# EasyEDA Pro project 工科赛(1)(2)(1).eprj

# Schematic Schematic1
Board Name: 工科赛; Create Date: 2025-07-13; Page Name: P1; Project Name: 工科赛(1)(2)(1); Schematic Name: Schematic1; Update Date: 2025-10-09; Company: 嘉立创EDA; Page Size: A4; Version: V1.0
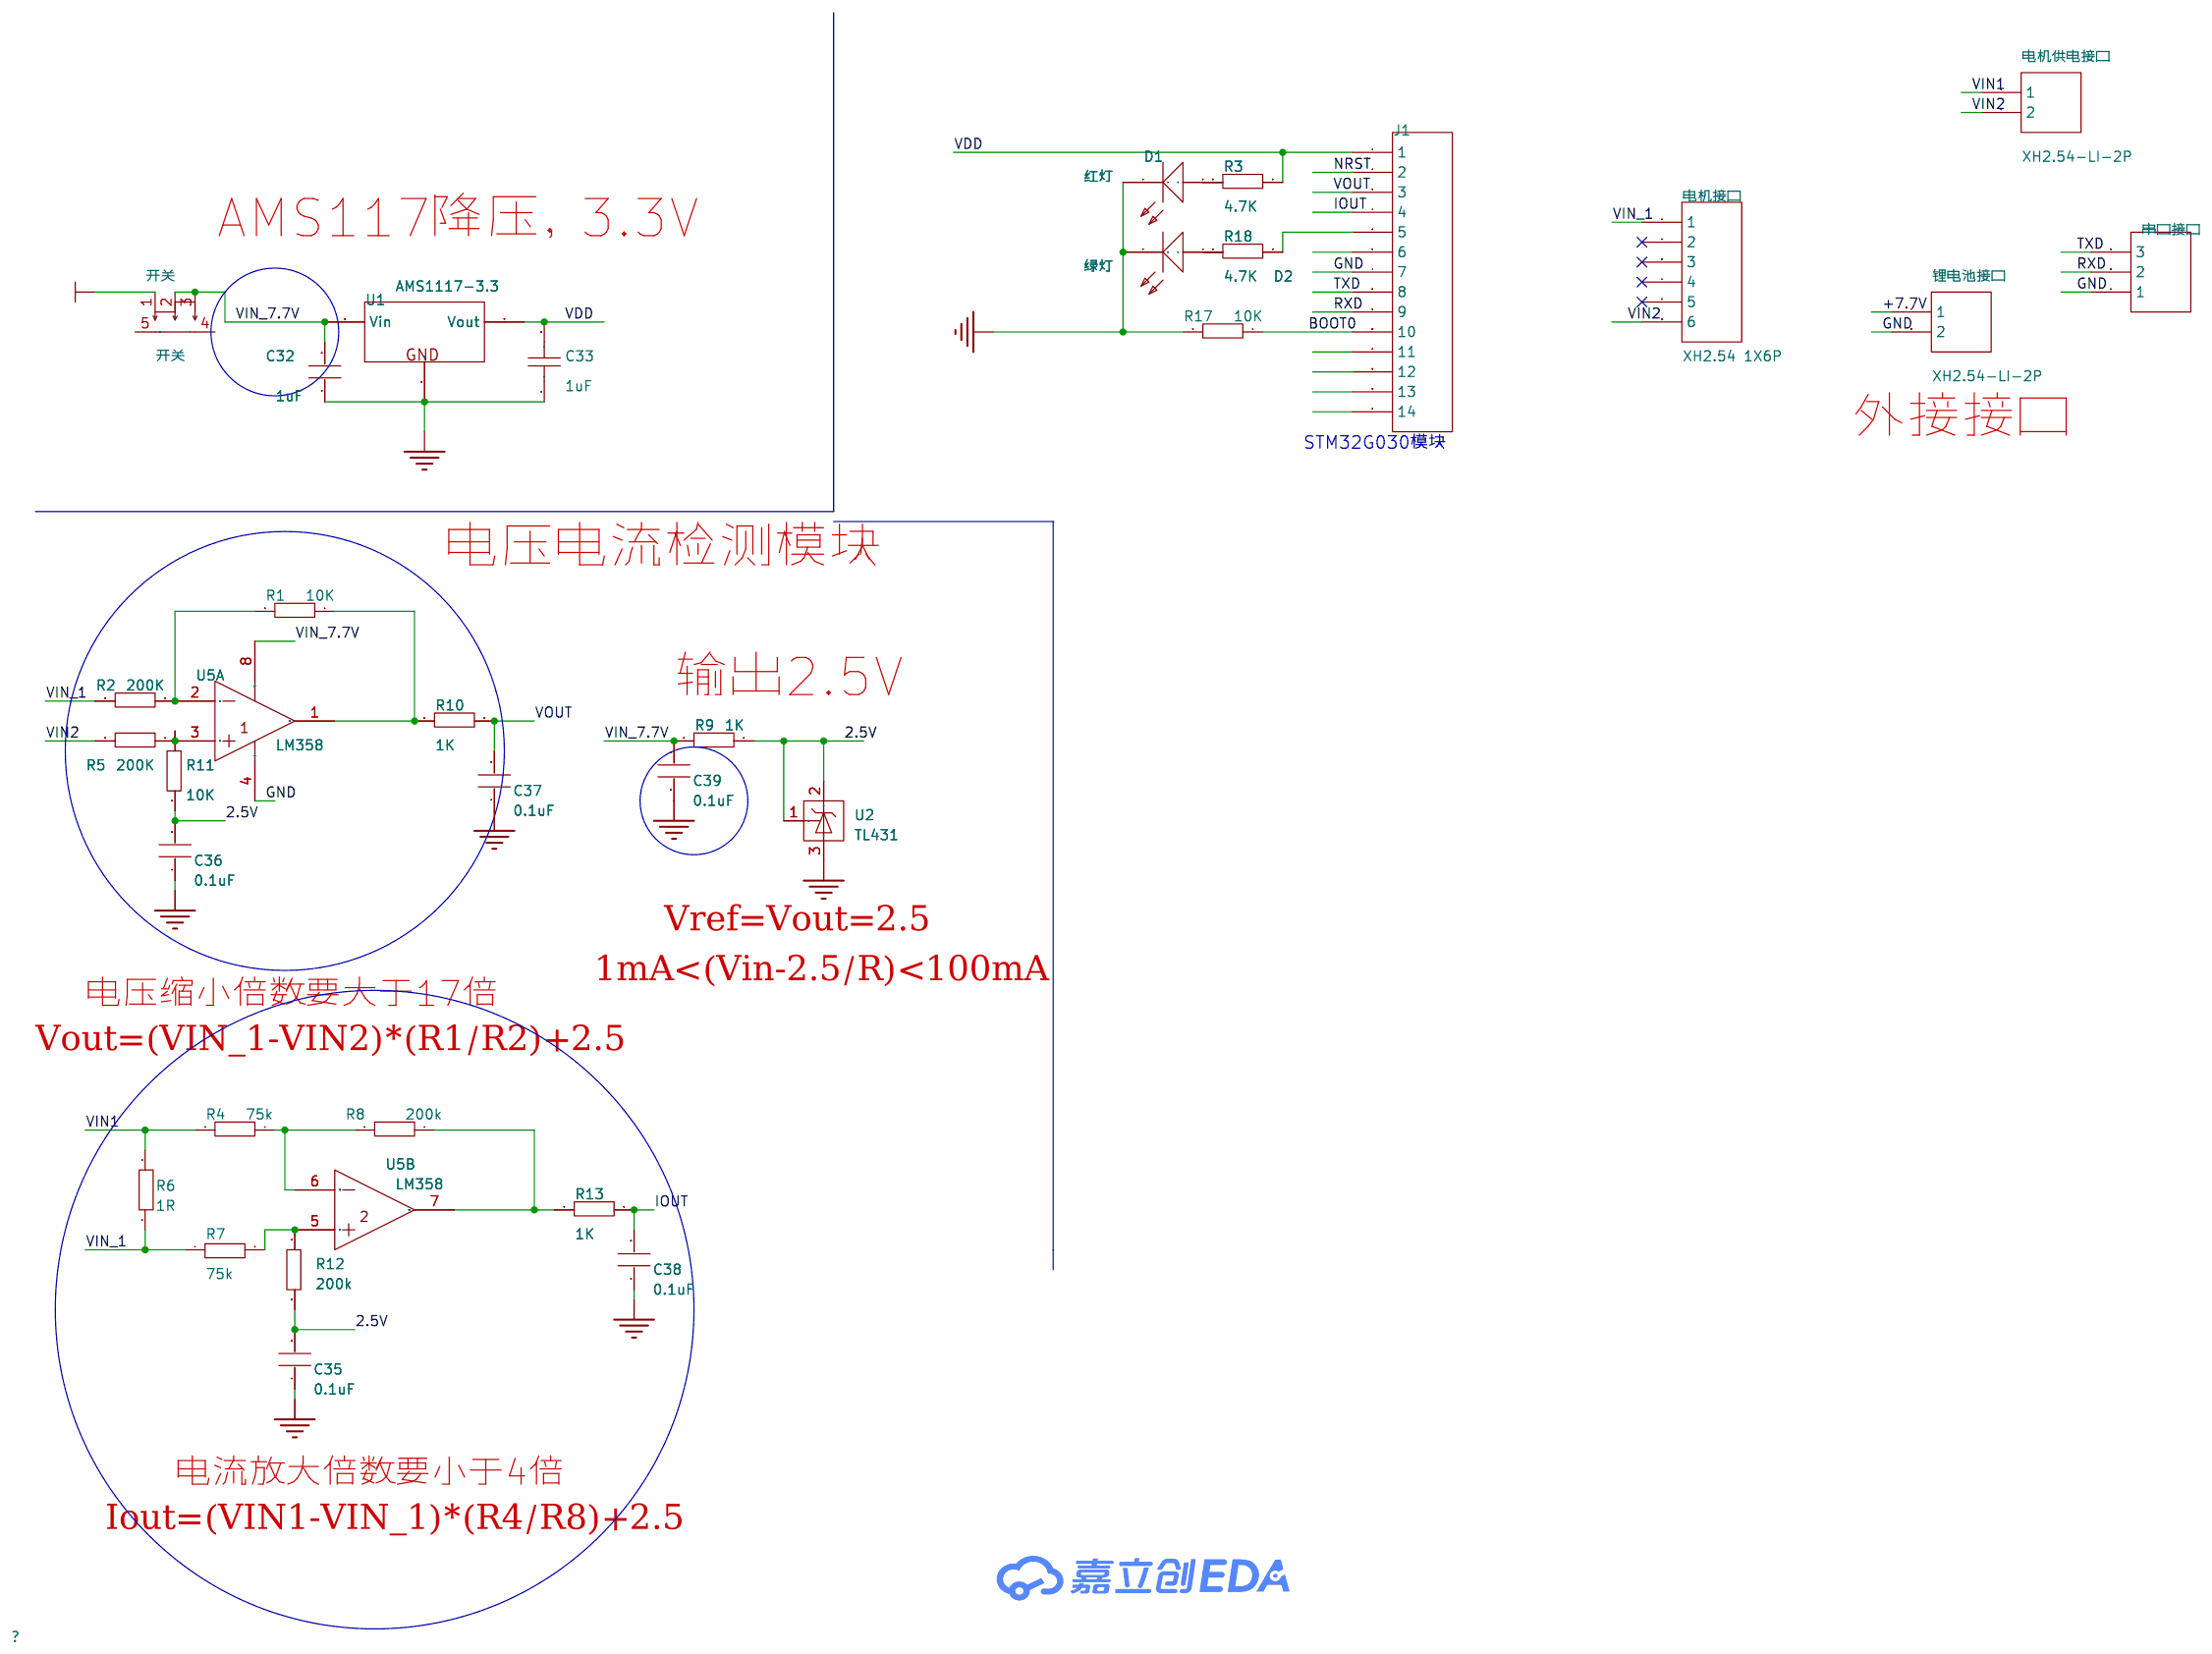
[diagram p0: schematic sheet]

## Parts
C32  1uF  [0805_C]
C33  1uF  [C0805]
C35  0.1uF  [0805_C]
C36  0.1uF  [0805_C]
C37  0.1uF  [0805_C]
C38  0.1uF  [0805_C]
C39  0.1uF  [0805_C]
D1  红灯  [0805_LED_S1]
D2  绿灯  [0805_LED_S1]
J1  STM32G030模块  [STM32_PACK]
R1  10K  [0805_R]
R2  200K  [0805_R]
R3  4.7K  [0805_R]
R4  75k  [0805_R]
R5  200K  [0805_R]
R6  1R  [0805_R]
R7  75k  [0805_R]
R8  200k  [0805_R]
R9  1K  [0805_R]
R10  1K  [0805_R]
R11  10K  [0805_R]
R12  200k  [0805_R]
R13  1K  [0805_R]
R17  10K  [0805_R]
R18  4.7K  [0805_R]
U1  AMS1117-3.3  [SOT-223]
U2  TL431  [SOT-23-3]
U5  LM358  [SOIC-8]  (sections 1,2)
串口接口  XH 1X3P  [HDR2.54-LI-3P]
开关  开关  [SW-TH_DEALON_SS-12D02-VGX]
电机供电接口  XH2.54-LI-2P  [XH2.54-LI-2P]
电机接口  XH2.54 1X6P  [XH2.54-LI-6P]
锂电池接口  XH2.54-LI-2P  [XH2.54-LI-2P]

## Library data of the parts
C32 = 1uF
C33 = CC0805KRX7R9BB104: 容值:100nF;精度:±10%;额定电压:50V;材质(温度系数):X7R;; LCSC Part Name: 100nF ±10% 50V; Supplier Part: C49678; Manufacturer: YAGEO(国巨); Supplier Footprint: 0805; JLCPCB Part Class: 基础库; Datasheet: https://atta.szlcsc.com/upload/public/pdf/source/20180224/C181747_15194369449651363981.pdf; Supplier: LCSC; Tolerance: ±10%; Voltage Rated: 50V; Temperature Coefficient: X7R
C35-C39 = 0.1uF
D1 = 红灯 0805: ComponentLink1Description: 供应商链接; ComponentLink1URL: http://www.szlcsc.com/product/details_2668.html; Supplier: LC; SuppliersPartNumber: C2295
D2 = 绿灯: ComponentLink1Description: 供应商链接; ComponentLink1URL: http://www.szlcsc.com/product/details_2668.html; Supplier: LC; SuppliersPartNumber: C2295
J1 = STM32G030模块: LatestRevisionDate: 17-Jul-2002; LatestRevisionNote: Re-released for DXP Platform.; Publisher: Altium Limited
R1 R2 R4 R5 R7-R9 R11 R12 R17 = 10K
R3 R18 = 1K
R6 = 1R
R10 R13 = 4.7K
U1 = AMS1117-3.3: ComponentLink1Description: 供应商链接; ComponentLink1URL: http://www.szlcsc.com/product/details_6652.html; Supplier: LC; SuppliersPartNumber: C6186
U2 = TL431
U5 = LM358
串口接口 = XH 1X3P: LatestRevisionDate: 17-Jul-2002; LatestRevisionNote: Re-released for DXP Platform.; Publisher: Altium Limited
开关 = SS-12D02-VG4: Supplier Part: C2998801; Manufacturer: DEALON(德艺隆); Supplier Footprint: 插件; JLCPCB Part Class: Extended Part; Datasheet: https://atta.szlcsc.com/upload/public/pdf/source/20220425/3145953AA816D3345B9B6BC6DFA6A3BA.pdf; Supplier: LCSC; Circuit: 单刀双掷; Mounting Style: 直插; Actuator Color: 黑色; Actuator Style: 矩形柱状; Pin Style: PC引脚; Switch Length: 8.7mm; Switch Width: 4.5mm
电机供电接口 锂电池接口 = XH-2A: LatestRevisionDate: 17-Jul-2002; LatestRevisionNote: Re-released for DXP Platform.; Publisher: Altium Limited
电机接口 = XH2.54 1X6P: LatestRevisionDate: 17-Jul-2002; LatestRevisionNote: Re-released for DXP Platform.; Publisher: Altium Limited

## Nets
2.5V: C35.2 C36.2 R9.1 R11.2 R12.2 U2.1(R) U2.2(K)
+7.7V: 开关.1 锂电池接口.1
GND: C32.1 C33.1 C35.1 C36.1 C37.1 C38.1 C39.1 D1.K D2.K J1.7 R17.2 U1.1(GND) U2.3(A) U5.4(VSS) 串口接口.1 锂电池接口.2
VDD: C33.2 J1.1 R3.1 U1.2(Vout)
VIN1: R4.2 R6.2 电机供电接口.1
VIN2: R5.2 电机供电接口.2 电机接口.6
VIN_1: R2.2 R6.1 R7.1 电机接口.1
VIN_7.7V: C32.2 C39.2 R9.2 U1.3(Vin) U5.8(VDD) 开关.2 开关.3
BOOT0: J1.10 R17.1
IOUT: C38.2 J1.4 R13.1
NRST: J1.2
RXD: J1.9 串口接口.2
TXD: J1.8 串口接口.3
VOUT: C37.2 J1.3 R10.1
$1N803: J1.5 R18.1
$1N1665: R1.2 R2.1 U5.2(-INA)
$1N1863: R1.1 R10.2 U5.1(OUTA)
$1N2240: D2.A R18.2
$1N2244: R5.1 R11.1 U5.3(+INA)
$1N2752: D1.A R3.2
$1N2945: R4.1 R8.2 U5.6(-INB)
$1N7932: R8.1 R13.2 U5.7(OUTB)
$1N12063: R7.2 R12.1 U5.5(+INB)

Not connected (* = marked no-connect by the designer): J1 6 11 12 13 14; 开关 4 5; 电机接口 2* 3* 4* 5*

## Notes on the sheet
- AMS117降压，3.3V
- 外接接口
- STM32G030模块
- 电压电流检测模块
- 输出2.5V
- Vref=Vout=2.5
- 1mA<(Vin-2.5/R)<100mA
- 电压缩小倍数要大于17倍
- Vout=(VIN_1-VIN2)*(R1/R2)+2.5
- 电流放大倍数要小于4倍
- Iout=(VIN1-VIN_1)*(R4/R8)+2.5

# Schematic Schematic2
Board Name: STM32G0; Create Date: 2025-07-23; Page Name: P1; Project Name: 工科赛(1)(2)(1); Schematic Name: Schematic2; Update Date: 2025-07-23; Company: 嘉立创EDA; Page Size: A4; Version: V1.0
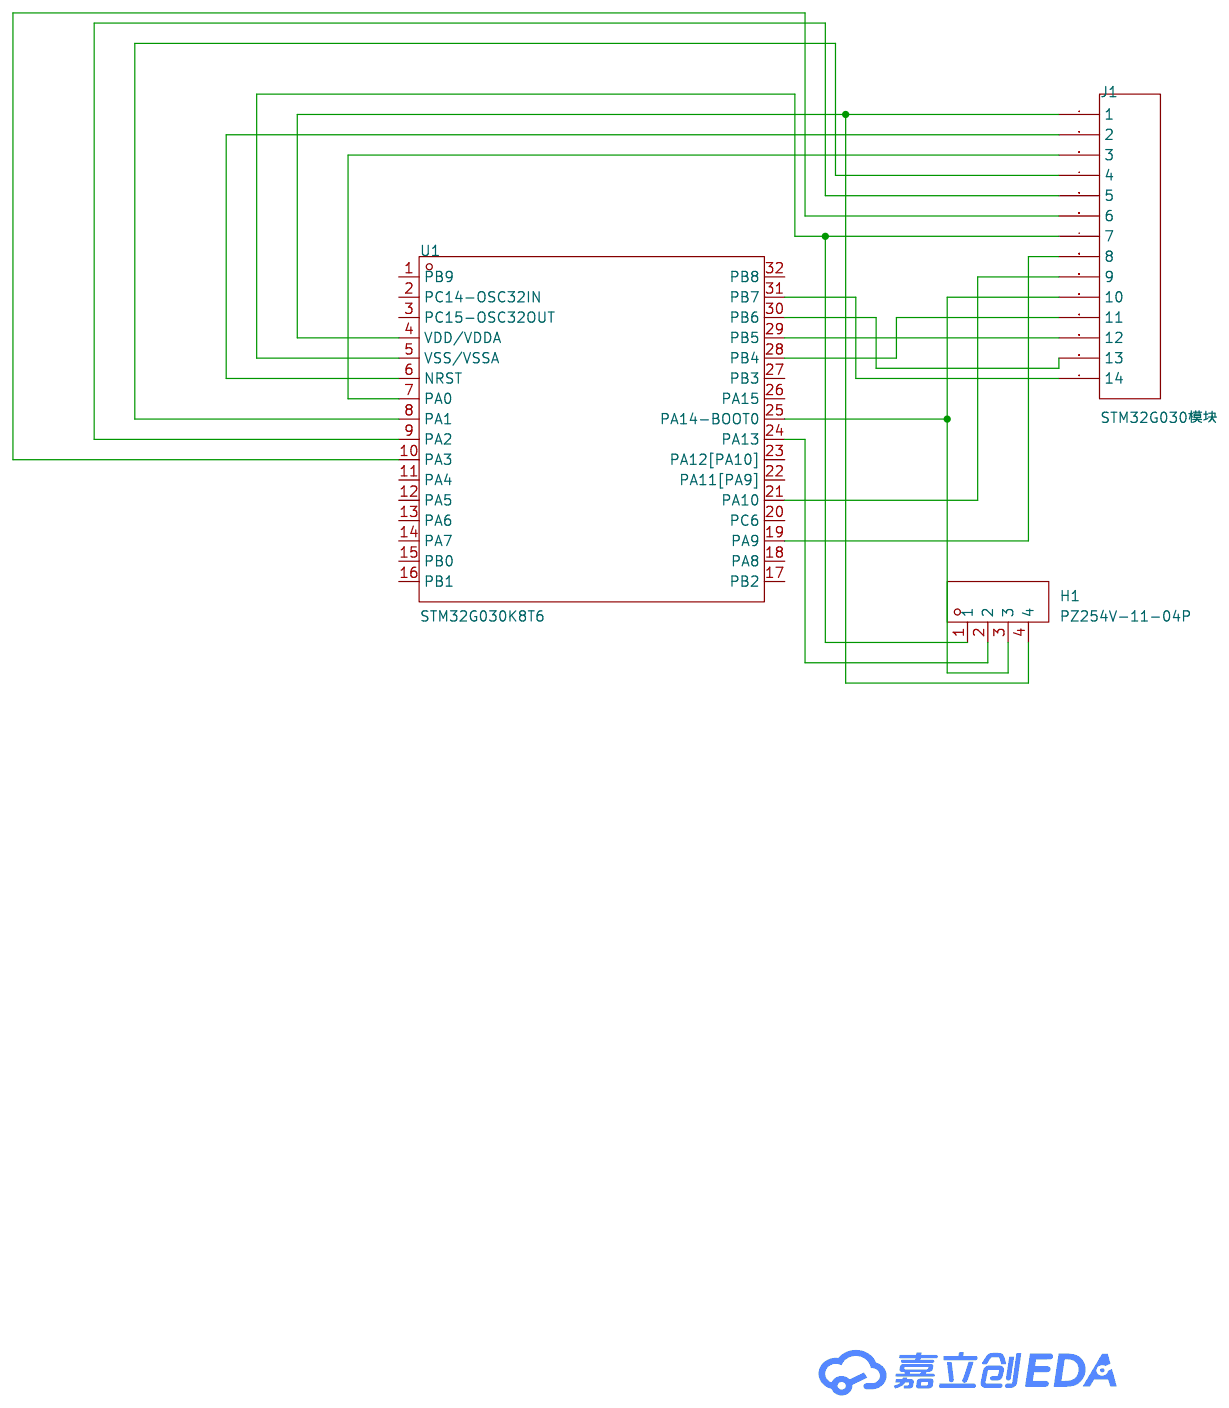
[diagram p1: schematic sheet]

## Parts
H1  PZ254V-11-04P  [HDR-TH_4P-P2.54-V-M]
J1  STM32G030模块  [STM32_PACK]
U1  STM32G030K8T6  [LQFP-32_L7.0-W7.0-P0.80-LS9.0-BL]

## Library data of the parts
H1 = PZ254V-11-04P: LCSC Part Name: 间距:2.54mm 1x4P 直插 方针; Supplier Part: C2691448; Manufacturer: XFCN(兴飞); Supplier Footprint: 插件,P=2.54mm; Datasheet: https://atta.szlcsc.com/upload/public/pdf/source/20200309/C492403_F9F19131791D08044AD4F84F8E751A34.pdf; Supplier: LCSC; Pin Structure: 1x4P; Pitch: 2.54mm; Circluar Pins/Square Pins: 方针; Mounting Type: 直插; Number of Rows: 单排; Number of Pins: 4P; Current Rating (Max): 3A; Voltage Rating (Max): 250V; Length of Mating Pin: 6mm; Insulation Height: 2.5mm; Length of End Connection Pin: 3mm; Operating Temperature Range: -40℃~+105℃; Color: 黑色
J1 = STM32G030模块: LatestRevisionDate: 17-Jul-2002; LatestRevisionNote: Re-released for DXP Platform.; Publisher: Altium Limited
U1 = STM32G030K8T6: LCSC Part Name: 主流超值系列Arm Cortex-M0+ MCU，具有64 KB Flash存储器、8 KB RAM、64 MHz CPU、2x USART、定时器、ADC和通信接口，2-3.6V; Supplier Part: C431631; Manufacturer: ST(意法半导体); Supplier Footprint: LQFP-32(7x7); JLCPCB Part Class: 扩展库; Datasheet: https://atta.szlcsc.com/upload/public/pdf/source/20231025/A81AA8E2745E91B6259F8698A040F162.pdf; Supplier: LCSC; CPU Core: ARM-M0; CPU Maximum Speed: 64MHz; Program Storage Size: 64KB; Program Memory Type: FLASH; Number of I/O: 30; ADC (Bit): 12bit; Low Voltage Detection Threshold: 2V~3.6V

## Nets
$1N501: H1.1 J1.7 U1.5(VSS/VSSA)
$1N519: H1.4 J1.1 U1.4(VDD/VDDA)
$1N534: J1.2 U1.6(NRST)
$1N544: J1.3 U1.7(PA0)
$1N552: J1.4 U1.8(PA1)
$1N561: J1.5 U1.9(PA2)
$1N593: J1.6 U1.10(PA3)
$1N667: J1.14 U1.31(PB7)
$1N673: J1.13 U1.30(PB6)
$1N680: J1.12 U1.29(PB5)
$1N689: J1.11 U1.28(PB4)
$1N746: J1.8 U1.19(PA9)
$1N754: J1.9 U1.21(PA10)
$1N766: H1.3 J1.10 U1.25(PA14-BOOT0)
$1N1001: H1.2 U1.24(PA13)

Not connected (* = marked no-connect by the designer): U1 1(PB9) 2(PC14-OSC32IN) 3(PC15-OSC32OUT) 11(PA4) 12(PA5) 13(PA6) 14(PA7) 15(PB0) 16(PB1) 17(PB2) 18(PA8) 20(PC6) 22(PA11[PA9]) 23(PA12[PA10]) 26(PA15) 27(PB3) 32(PB8)

# Board PCB1
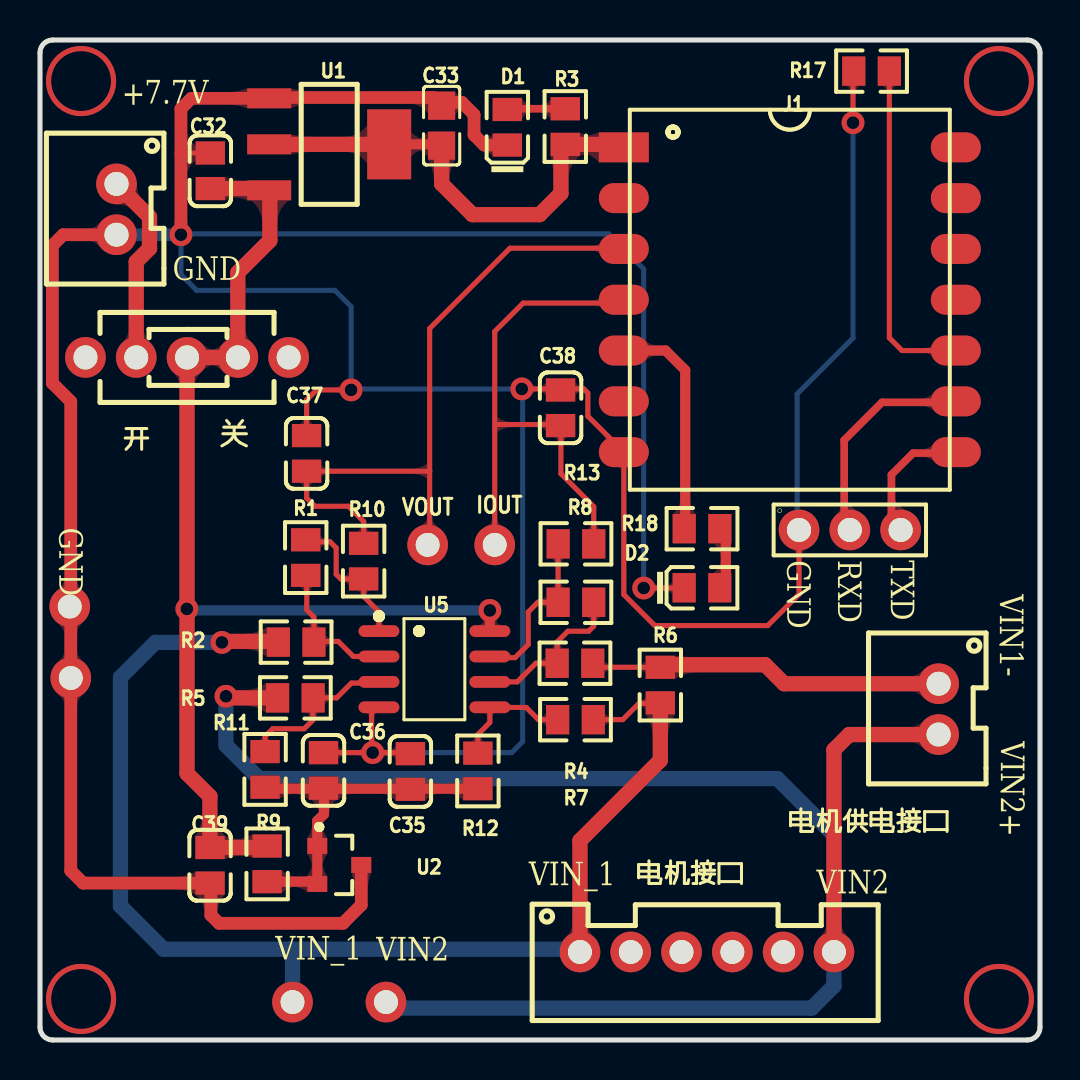
[diagram p2: board, top side]
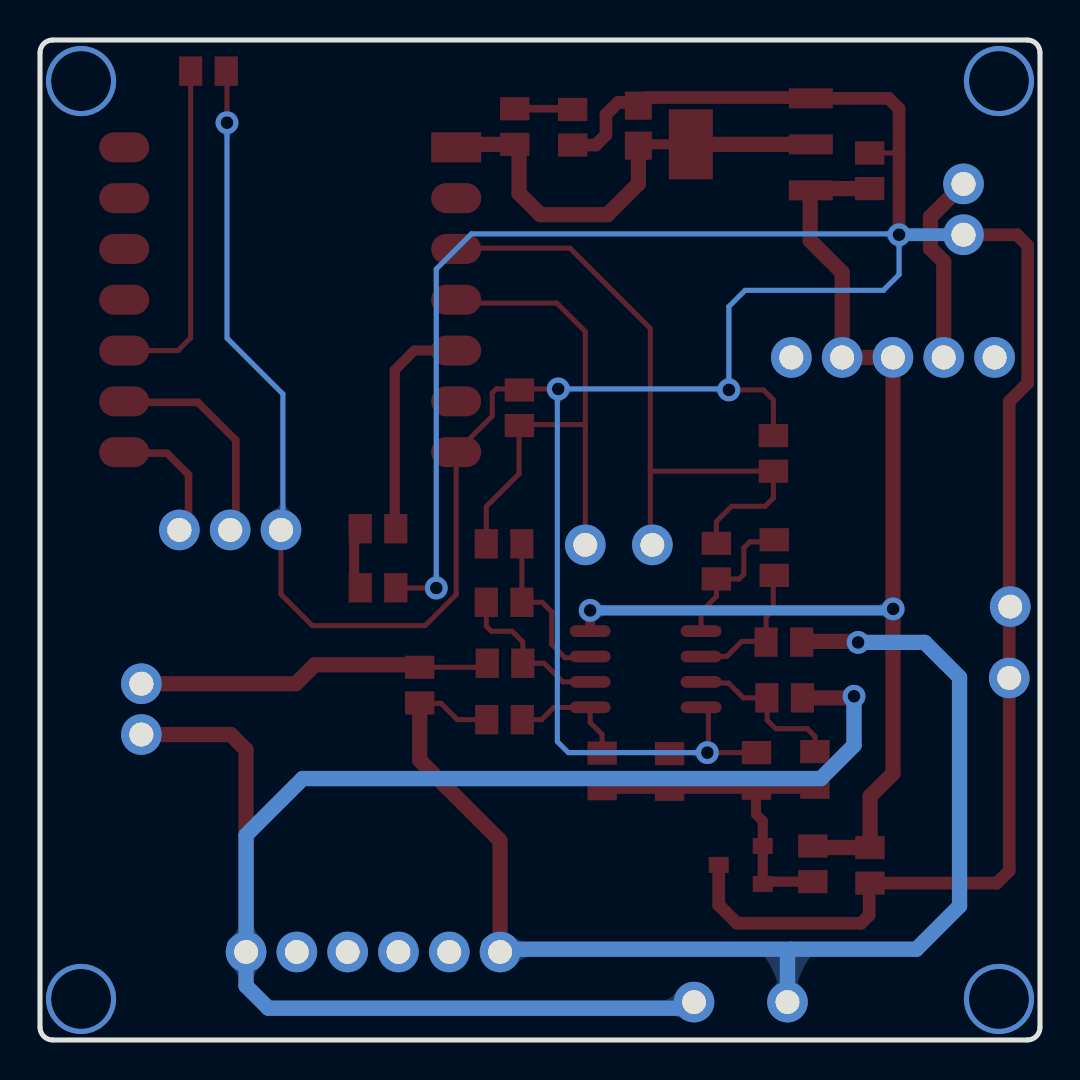
[diagram p3: board, bottom side, seen from below]

Outline 50 x 50 mm; copper layers: Top Layer, Bottom Layer. Coordinates in mm from the lower left corner of the outline.
Outline path: 0,49.37 0,0.64 arc(0.19,0.19) 0.63,0 49.37,0 arc(49.81,0.19) 50,0.64 50,49.37 arc(49.81,49.81) 49.37,50 0.63,50 arc(0.19,49.81) 0,49.37
Stack: Top Layer 0.035mm / Dielectric1 1.51mm FR4 er 4.5 / Bottom Layer 0.035mm

## Design rules (mm)
template: 自定义配置
spacing copperThickness1oz (default): track to track 0.254, other pairs 0.152 to 0.508
spacing copperThickness2oz: track to track 0.203, other pairs 0.152 to 0.3
track width copperThickness1oz (default): min 0.254, default 0.254, max 2.54
track width copperThickness2oz: min 0.203, default 0.254, max 2.54
differential pair differentialPair (default): width min 0.127, default 0.254, max 2.54; gap min 0.152, default 0.152
via viaSize (default): diameter min 0.5, default 1.143, max 10; hole min 0.635, default 0.635, max 6.299

## Placement (name value [footprint] x y rotation side)
C32  1uF  [0805_C]  8.52 43.46 270 top
C33  1uF  [C0805]  20.08 45.72 270 top
C35  0.1uF  [0805_C]  18.52 13.43 270 top
C36  0.1uF  [0805_C]  14.18 13.48 270 top
C37  0.1uF  [0805_C]  13.33 29.33 270 top
C38  0.1uF  [0805_C]  26.03 31.61 270 top
C39  0.1uF  [0805_C]  8.5 8.74 90 top
D1  红灯  [0805_LED_S1]  23.37 45.64 90 top
D2  绿灯  [0805_LED_S1]  33.1 22.61 0 top
J1  STM32G030模块  [STM32_PACK]  37.49 37.01 0 top
NOREF  -  [Pad_e0]  12.63 1.9 0 top
NOREF#2  -  [Pad_e38]  22.74 24.76 0 top
NOREF#3  -  [Pad_e36]  19.38 24.76 0 top
NOREF#4  -  [Pad_e522]  1.49 21.67 90 top
NOREF#5  -  [Pad_e520]  1.54 18.1 90 top
NOREF#6  -  [Pad_e1]  17.3 1.9 0 top
R1  10K  [0805_R]  13.29 24.12 270 top
R2  200K  [0805_R]  12.81 19.89 180 top
R3  4.7K  [0805_R]  26.26 45.67 90 top
R4  75k  [0805_R]  26.75 18.84 0 top
R5  200K  [0805_R]  12.77 17.11 180 top
R6  1R  [0805_R]  31.02 17.75 90 top
R7  75k  [0805_R]  26.77 16.02 180 top
R8  200k  [0805_R]  26.79 21.89 0 top
R9  1K  [0805_R]  11.36 8.81 90 top
R10  1K  [0805_R]  16.18 23.94 270 top
R11  10K  [0805_R]  11.25 13.53 270 top
R12  200k  [0805_R]  21.89 13.45 270 top
R13  1K  [0805_R]  26.8 24.81 180 top
R17  10K  [0805_R]  41.58 48.44 180 top
R18  4.7K  [0805_R]  33.1 25.57 0 top
U1  AMS1117-3.3  [SOT-223]  14.46 44.78 180 top
U2  TL431  [SOT-23-3]  14.96 8.75 0 top
U5  LM358  [SOIC-8]  19.72 18.54 270 top
串口接口  XH 1X3P  [HDR2.54-LI-3P]  40.49 25.5 0 top
开  开关  [SW-TH_DEALON_SS-12D02-VGX]  7.35 34.13 0 top
电机供电接口  -  [XH2.54-LI-2P]  44.93 16.54 270 top
电机接口  XH2.54 1X6P  [XH2.54-LI-6P]  33.35 4.4 0 top
锂电池接口  -  [XH2.54-LI-2P]  3.82 41.53 270 top

## Footprints (pads in the part's own frame, mm; a bottom-side part is the same pattern mirrored in y, then rotated)
0805_C
  rect 1.16x1.47 smd: 1(-0.89,0) 2(0.89,0)
0805_LED_S1
  rect 1.16x1.47 smd: A(0.89,0) K(-0.89,0)
0805_R
  rect 1.16x1.47 smd: 1(-0.89,0) 2(0.89,0)
C0805
  rect 1.41x1.35 smd: 1(-1,0) 2(1,0)
HDR2.54-LI-3P
  round 2.032 hole 1.205x1.194: 1(-2.54,0) 2(0,0) 3(2.54,0)
Pad_e0
  round 2.032 hole 1.194: TP1(0,0)
Pad_e1
  round 2.032 hole 1.194: TP1(0,0)
Pad_e36
  round 2.032 hole 1.194: TP1(0,0)
Pad_e38
  round 2.032 hole 1.194: TP2(0,0)
Pad_e520
  round 2.032 hole 1.194: TP1(0,0)
Pad_e522
  round 2.032 hole 1.194: TP1(0,0)
SOIC-8
  oval 0.588x2.045 smd: 1(-1.905,-2.772) 2(-0.635,-2.772) 3(0.635,-2.772) 4(1.905,-2.772) 5(1.905,2.772) 6(0.635,2.772) 7(-0.635,2.772) 8(-1.905,2.772)
SOT-23-3
  rect 1x0.8 smd: 1(-1.1,0.95) 2(-1.1,-0.95) 3(1.1,0)
SOT-223
  rect 2.2x1 smd: 1(3,-2.3) 2(3,0) 3(3,2.3)
  rect 2.2x3.5 smd: 2(-3,0)
STM32_PACK
  rect 2.5x1.5 smd: 1(-8.3,7.62)
  oval 2.5x1.5 smd: 2(-8.3,5.08) 3(-8.3,2.539) 4(-8.3,-0.001) 5(-8.3,-2.541) 6(-8.3,-5.08) 7(-8.3,-7.62) 8(8.3,-7.62) 9(8.3,-5.08) 10(8.3,-2.541) 11(8.3,-0.001) 12(8.3,2.539) 13(8.3,5.08) 14(8.3,7.62)
SW-TH_DEALON_SS-12D02-VGX
  round 2.032 hole 1.194x1.205: 1(-2.54,0) 2(0,0) 3(2.54,0) 4(5.08,0) 5(-5.08,0)
XH2.54-LI-2P
  round 2.032 hole 1.194x1.205: 1(-1.27,0) 2(1.27,0)
XH2.54-LI-6P
  round 2.032 hole 1.194: 1(-6.35,0) 2(-3.81,0) 3(-1.27,0) 4(1.27,0) 5(3.81,0) 6(6.35,0)

## Nets
2.5V: C35.2 C36.2 R9.1 R11.2 R12.2 U2.1 U2.2
+7.7V: 开.1 锂电池接口.1
GND: C32.1 C33.1 C35.1 C36.1 C37.1 C38.1 C39.1 D1.K D2.K J1.7 NOREF#4.TP1 NOREF#5.TP1 R17.2 U1.1 U2.3 U5.4 串口接口.1 锂电池接口.2
VDD: C33.2 J1.1 R3.1 U1.2
VIN1: R4.2 R6.2 电机供电接口.1
VIN2: NOREF#6.TP1 R5.2 电机供电接口.2 电机接口.6
VIN_1: NOREF.TP1 R2.2 R6.1 R7.1 电机接口.1
VIN_7.7V: C32.2 C39.2 R9.2 U1.3 U5.8 开.2 开.3
BOOT0: J1.10 R17.1
IOUT: C38.2 J1.4 NOREF#2.TP2 R13.1
NRST: J1.2
RXD: J1.9 串口接口.2
TXD: J1.8 串口接口.3
VOUT: C37.2 J1.3 NOREF#3.TP1 R10.1
$1N803: J1.5 R18.1
$1N807: J1.6
$1N832: J1.11
$1N837: J1.12
$1N842: J1.13
$1N847: J1.14
$1N1665: R1.2 R2.1 U5.2
$1N1863: R1.1 R10.2 U5.1
$1N2240: D2.A R18.2
$1N2244: R5.1 R11.1 U5.3
$1N2752: D1.A R3.2
$1N2945: R4.1 R8.2 U5.6
$1N7932: R8.1 R13.2 U5.7
$1N12063: R7.2 R12.1 U5.5

Pads without a net: 开 4 5; 电机接口 2 3 4 5

## Via types
v1: diameter 3.505, hole 2.997, Top Layer to Bottom Layer, 4 vias
v2: diameter 1.143, hole 0.635, Top Layer to Bottom Layer, 10 vias

## Routing (per net, layer and track width the routed paths; a pad name or vN(x,y) marks a point on that pad's centre or on a via; arc(x,y) is an arc through that point)
2.5V: length 18.1
  Top Layer w0.508: 14.2,12.56 R12.2 ; 14.2,12.56 14.2,11.29 13.86,10.96 U2.1 U2.2 13.75,7.92 R9.1 ; 14.2,12.56 C36.2 ; 14.18,12.56 11.33,12.56 R11.2
+7.7V: length 9.6
  Top Layer w0.762: 开.1 4.81,38.92 5.48,39.58 5.48,41.15 锂电池接口.1
GND: length 237.2
  Top Layer w0.254: C35.1 18.47,14.37 v2(16.63,14.37) ; v2(40.65,45.87) 40.65,48.41 R17.2 ; v2(15.56,32.5) 13.83,32.5 13.33,32.01 C37.1 ; D2.K 32.2,22.6 v2(30.19,22.6) ; v2(16.63,14.37) C36.1 ; v2(16.63,14.37) 16.58,14.42 16.58,16.56 16.65,16.64 U5.4 ; 串口接口.1 37.95,22.29 36.38,20.72 30.74,20.72 29.19,22.27 J1.7 27.39,31.19 27.39,32.35 27.19,32.56 26.08,32.56 C38.1 25.98,32.55 v2(24.09,32.55) ; C32.1 7.05,44.35
  Top Layer w0.635: v2(7.05,40.26) 7.05,46.56 7.57,47.08 11.46,47.08 11.5,47.12 19.68,47.12 C33.1 20.25,46.88 21.09,46.88 21.7,46.27 21.7,45.26 22.21,44.75 D1.K ; U2.3 16.06,6.75 15.15,5.83 8.95,5.83 8.54,6.24 8.54,7.8 C39.1 2.16,7.85 1.54,8.46 NOREF#5.TP1 1.54,31.92 0.62,32.84 0.62,39.72 1.16,40.26 锂电池接口.2
  Bottom Layer w0.254: v2(30.19,22.6) 30.19,38.55 28.43,40.31 7.09,40.31 v2(7.05,40.26) 7.05,38.27 7.83,37.48 14.74,37.48 15.56,36.67 v2(15.56,32.5) 15.6,32.55 v2(24.09,32.55) 24.13,32.51 24.13,14.92 23.58,14.37 v2(16.63,14.37) ; v2(40.65,45.87) 40.65,35.1 37.86,32.3 37.86,25.6 串口接口.1
  Bottom Layer w0.635: 锂电池接口.2 v2(7.05,40.26)
VDD: length 23.1
  Top Layer w0.508: U1.2 20.02,44.78 C33.2
  Top Layer w0.762: J1.1 29.04,44.78 R3.1 26.05,44.57 26.05,42.33 24.98,41.27 21.63,41.27 20.08,42.81 C33.2 ; U1.2 U1.2
VIN1: length 17.8
  Top Layer w0.254: R6.2 27.84,18.64 R4.2
  Top Layer w0.762: 电机供电接口.1 37.21,17.81 36.26,18.76 31.14,18.76 R6.2
VIN2: length 84.5
  Top Layer w0.762: 电机接口.6 39.7,14.51 40.46,15.27 44.93,15.27 电机供电接口.2 ; v2(9.3,17.19) 9.38,17.11 11.88,17.11 ; 44.93,15.27 44.93,15.27
  Bottom Layer w0.762: 电机接口.6 39.7,4.2 ; 39.7,4.2 39.7,2.7 38.59,1.59 17.6,1.59 NOREF#6.TP1 ; 39.7,4.2 40.26,4.76 ; v2(9.3,17.19) 9.3,14.73 10.96,13.07 36.87,13.07 39.7,10.24 39.7,4.2
VIN_1: length 65.1
  Top Layer w0.254: R7.1 27.67,16.02 29.14,16.02 29.95,16.83 30.84,16.83 31.02,16.65
  Top Layer w0.762: 31.02,16.65 31.02,13.99 27,9.97 电机接口.1 ; v2(9.1,19.88) 9.15,19.93 11.6,19.93 11.92,19.62
  Bottom Layer w0.762: 27.56,4.76 27.34,4.54 12.47,4.54 ; 12.47,4.54 6.18,4.54 4.02,6.7 4.02,18.13 5.77,19.88 v2(9.1,19.88) ; 12.47,4.54 12.63,4.38 NOREF.TP1
VIN_7.7V: length 58.5
  Top Layer w0.508: U5.8 v2(22.49,21.48)
  Top Layer w0.762: U1.3 11.49,42.45 11.49,39.97 9.89,38.37 开.3 开.2 7.35,13.33 8.49,12.18 8.49,9.63 8.5,9.62 11.28,9.62 R9.2 ; C32.2 11.37,42.57
  Bottom Layer w0.508: v2(7.34,21.56) 7.42,21.48 v2(22.49,21.48)
(no net):
  vias: v1(2.05,47.95) v1(2.05,2.05) v1(47.95,47.95) v1(47.95,2.05)
BOOT0: length 16.9
  Top Layer w0.254: J1.10 43.1,34.47 42.47,35.11 R17.1
IOUT: length 28.3
  Top Layer w0.254: 29.7,37.01 29.53,36.85 24.16,36.85 22.74,35.42 22.74,30.79 ; NOREF#2.TP2 22.74,30.79 ; 22.74,30.79 22.76,30.77 26.05,30.77 26.05,28.31 27.69,26.67 R13.1
RXD: length 11.4
  Top Layer w0.381: 46.45,31.88 42.1,31.88 40.21,29.99 40.21,25.93 40.01,25.73
TXD: length 6.9
  Top Layer w0.381: 46.45,29.34 43.65,29.34 42.57,28.26 42.57,25.75 42.55,25.73
VOUT: length 35
  Top Layer w0.254: 29.7,39.55 29.66,39.59 23.5,39.59 19.48,35.58 19.48,28.43 ; 19.48,28.43 19.48,24.65 19.31,24.83 ; 19.48,28.43 19.47,28.44 C37.2 13.33,27.1 13.74,26.69 15.42,26.69 16.18,25.92 R10.1
$1N803: length 10.9
  Top Layer w0.508: R18.1 32.26,25.61 32.26,33.49 31.28,34.47 29.7,34.47
$1N1665: length 6.9
  Top Layer w0.254: 13.34,23.08 13.34,21.51 13.7,21.15 13.7,19.95 13.71,19.93 14.91,19.93 15.67,19.18 U5.2
$1N1863: length 7.4
  Top Layer w0.254: U5.1 16.95,21.41 16.18,22.18 R10.2 15.04,23.05 14.81,23.28 14.81,24.6 14.51,24.91 13.39,24.91 R1.1
$1N2240: length 3
  Top Layer w0.508: 34.25,25.57 34.29,25.52 34.29,22.61
$1N2244: length 8.2
  Top Layer w0.254: R11.1 11.25,15.18 11.64,15.56 13.21,15.56 13.64,16 13.64,17.09 R5.1 14.83,17.11 15.57,17.85 16.89,17.85 U5.3
$1N2752: length 2.6
  Top Layer w0.381: 26.49,46.56 23.91,46.56 23.89,46.58
$1N2945: length 8.2
  Top Layer w0.254: U5.6 23.86,17.91 24.79,18.84 R4.1 25.86,19.9 26.39,20.44 27.43,20.44 27.69,20.69 R8.2
$1N7932: length 8.5
  Top Layer w0.254: U5.7 22.55,19.12 23.75,19.12 24.41,19.78 24.41,21.4 24.89,21.89 R8.1 25.91,24.81 R13.2
$1N12063: length 6.2
  Top Layer w0.254: R7.2 24.92,16.02 24.31,16.63 22.5,16.63 U5.5 22.49,15.88 21.89,15.28 R12.1

Small or netless copper shapes (teardrops, artwork), in the pictures only: 132 on Top Layer, 20 on Bottom Layer

## Text on the board
Top Silkscreen Layer: VOUT | IOUT | GND | RXD | TXD | VIN1- | VIN2+ | +7.7V | 关 | VIN_1 | VIN2

# Board PCB2
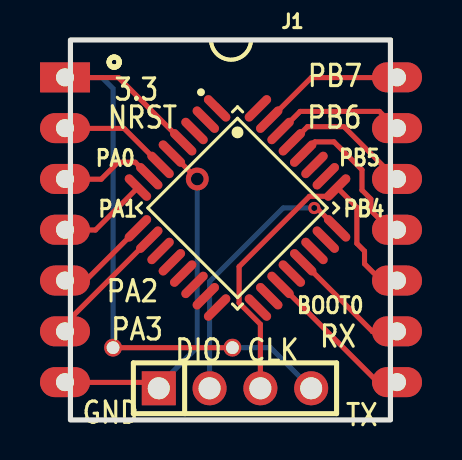
[diagram p4: board, top side]
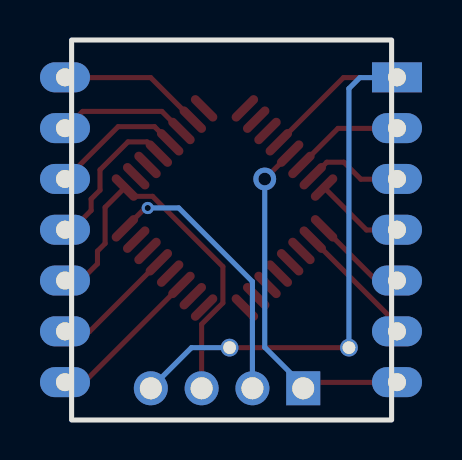
[diagram p5: board, bottom side, seen from below]

Outline 16 x 19 mm; copper layers: Top Layer, Bottom Layer. Coordinates in mm from the lower left corner of the outline.
Outline path: rectangle 0,19 16,0
Stack: Top Layer 0.035mm / Dielectric1 1.51mm FR4 er 4.5 / Bottom Layer 0.035mm

## Design rules (mm)
template: 自定义配置
spacing copperThickness1oz (default): track to track 0.102, other pairs 0.152 to 0.3
spacing copperThickness2oz: track to track 0.203, other pairs 0.152 to 0.3
track width copperThickness1oz (default): min 0.127, default 0.254, max 2.54
track width copperThickness2oz: min 0.203, default 0.254, max 2.54
differential pair differentialPair (default): width min 0.127, default 0.254, max 2.54; gap min 0.152, default 0.152
via viaSize (default): diameter min 0.5, default 0.61, max 10; hole min 0.3, default 0.305, max 6.3

## Placement (name value [footprint] x y rotation side)
H1  PZ254V-11-04P  [HDR-TH_4P-P2.54-V-M]  8.23 1.59 0 top
J1  STM32G030模块  [STM32_PACK]  8.03 9.51 0 top
NOREF  -  [Pad_e141]  8.1 3.62 0 top
NOREF#2  -  [Pad_e138]  2.13 3.62 0 top
U1  STM32G030K8T6  [LQFP-32_L7.0-W7.0-P0.80-LS9.0-BL]  8.36 10.6 225 top

## Footprints (pads in the part's own frame, mm; a bottom-side part is the same pattern mirrored in y, then rotated)
HDR-TH_4P-P2.54-V-M
  rect 1.7x1.7 hole 1.1: 1(-3.81,0)
  round 1.7 hole 1.1: 2(-1.27,0) 3(1.27,0) 4(3.81,0)
LQFP-32_L7.0-W7.0-P0.80-LS9.0-BL
  oval 0.448x1.684 smd: 1(-2.8,-4.242) 2(-2,-4.242) 3(-1.2,-4.242) 4(-0.4,-4.242) 5(0.4,-4.242) 6(1.2,-4.242) 7(2,-4.242) 8(2.8,-4.242) 17(2.8,4.242) 18(2,4.242) 19(1.2,4.242) 20(0.4,4.242) 21(-0.4,4.242) 22(-1.2,4.242) 23(-2,4.242) 24(-2.8,4.242)
  oval 1.684x0.448 smd: 9(4.242,-2.8) 10(4.242,-2) 11(4.242,-1.2) 12(4.242,-0.4) 13(4.242,0.4) 14(4.242,1.2) 15(4.242,2) 16(4.242,2.8) 25(-4.242,2.8) 26(-4.242,2) 27(-4.242,1.2) 28(-4.242,0.4) 29(-4.242,-0.4) 30(-4.242,-1.2) 31(-4.242,-2) 32(-4.242,-2.8)
Pad_e138
  round 0.889 hole 0.635: 1(0,0)
Pad_e141
  round 0.889 hole 0.635: 1(0,0)
STM32_PACK
  rect 2.5x1.5 hole 0.9: 1(-8.3,7.62)
  oval 2.5x1.5 hole 0.9: 2(-8.3,5.08) 3(-8.3,2.539) 4(-8.3,-0.001) 5(-8.3,-2.541) 6(-8.3,-5.08) 7(-8.3,-7.62) 8(8.3,-7.62) 9(8.3,-5.08) 10(8.3,-2.541) 11(8.3,-0.001) 12(8.3,2.539) 13(8.3,5.08) 14(8.3,7.62)

## Nets
As in the schematic, except:
$1N519: H1.4 J1.1 NOREF.1 NOREF#2.1 U1.4

Pads without a net: U1 1 2 3 11 12 13 14 15 16 17 18 20 22 23 26 27 32

## Via types
v1: diameter 1.143, hole 0.635, Top Layer to Bottom Layer, 1 via
v2: diameter 0.61, hole 0.305, Top Layer to Bottom Layer, 1 via

## Routing (per net, layer and track width the routed paths; a pad name or vN(x,y) marks a point on that pad's centre or on a via; arc(x,y) is an arc through that point)
$1N501: length 17.7
  Top Layer w0.254: -0.3,1.88 4.25,1.88 4.42,1.71 ; U1.5 v1(6.34,12.05)
  Bottom Layer w0.254: 4.42,1.71 6.34,3.64 v1(6.34,12.05)
$1N519: length 33.6
  Top Layer w0.254: U1.4 2.41,17.12 -0.3,17.12 ; NOREF#2.1 NOREF.1
  Bottom Layer w0.254: NOREF.1 10.01,3.62 H1.4 ; -0.3,17.12 1.59,17.12 2.13,16.57 NOREF#2.1
$1N534: length 5.6
  Top Layer w0.254: -0.3,14.58 2.68,14.58 4.51,12.75
$1N544: length 4.9
  Top Layer w0.254: U1.7 3.24,12.89 2.39,12.89 1.54,12.04 -0.3,12.04
$1N552: length 4.6
  Top Layer w0.254: U1.8 1.25,9.5 -0.3,9.5
$1N561: length 4.8
  Top Layer w0.254: U1.9 0.75,6.96 -0.3,6.96
$1N593: length 6.4
  Top Layer w0.254: U1.10 -0.3,4.78 -0.3,4.42
$1N667: length 7.2
  Top Layer w0.254: U1.31 12.04,17.12 16.3,17.12
$1N673: length 6.5
  Top Layer w0.254: U1.30 11.49,15.43 15.45,15.43 16.3,14.58
$1N680: length 6.6
  Top Layer w0.254: 16.3,12.04 13.67,14.67 11.85,14.67 U1.29
$1N689: length 7.7
  Top Layer w0.254: U1.28 12.22,13.91 13.18,13.91 14.58,12.51 14.58,11.49 15.02,11.05 15.02,10.48 16,9.5 16.3,9.5
$1N746: length 7.8
  Top Layer w0.254: 16.3,1.88 15.38,1.88 U1.19
$1N754: length 6.1
  Top Layer w0.254: U1.21 15.1,4.42 16.3,4.42
$1N766: length 19.4
  Top Layer w0.254: H1.3 9.5,4.79 8.44,5.85 8.44,7.67 11.95,11.18 12.9,11.18 U1.25 14.32,10.63 14.32,8.83 14.71,8.44 14.71,7.81 15.56,6.96 16.3,6.96
$1N1001: length 13.5
  Top Layer w0.254: v2(12.19,10.6) 12.32,10.6 U1.24
  Bottom Layer w0.254: v2(12.19,10.6) 12.19,10.6 10.64,10.6 6.96,6.92 6.96,1.71

## Text on the board
Top Silkscreen Layer: PA0 | PA1 | BOOT0 | PB5 | PB4 | GND | PA2 | NRST | PA3 | 3.3 | DIO | CLK | PB6 | PB7 | RX | TX
